# Altium schematic sheet Driver.SchDoc
size A4; Author: Shohei Aoki; Organization: Shokara Inc.; Address1: Yokohama, Japan
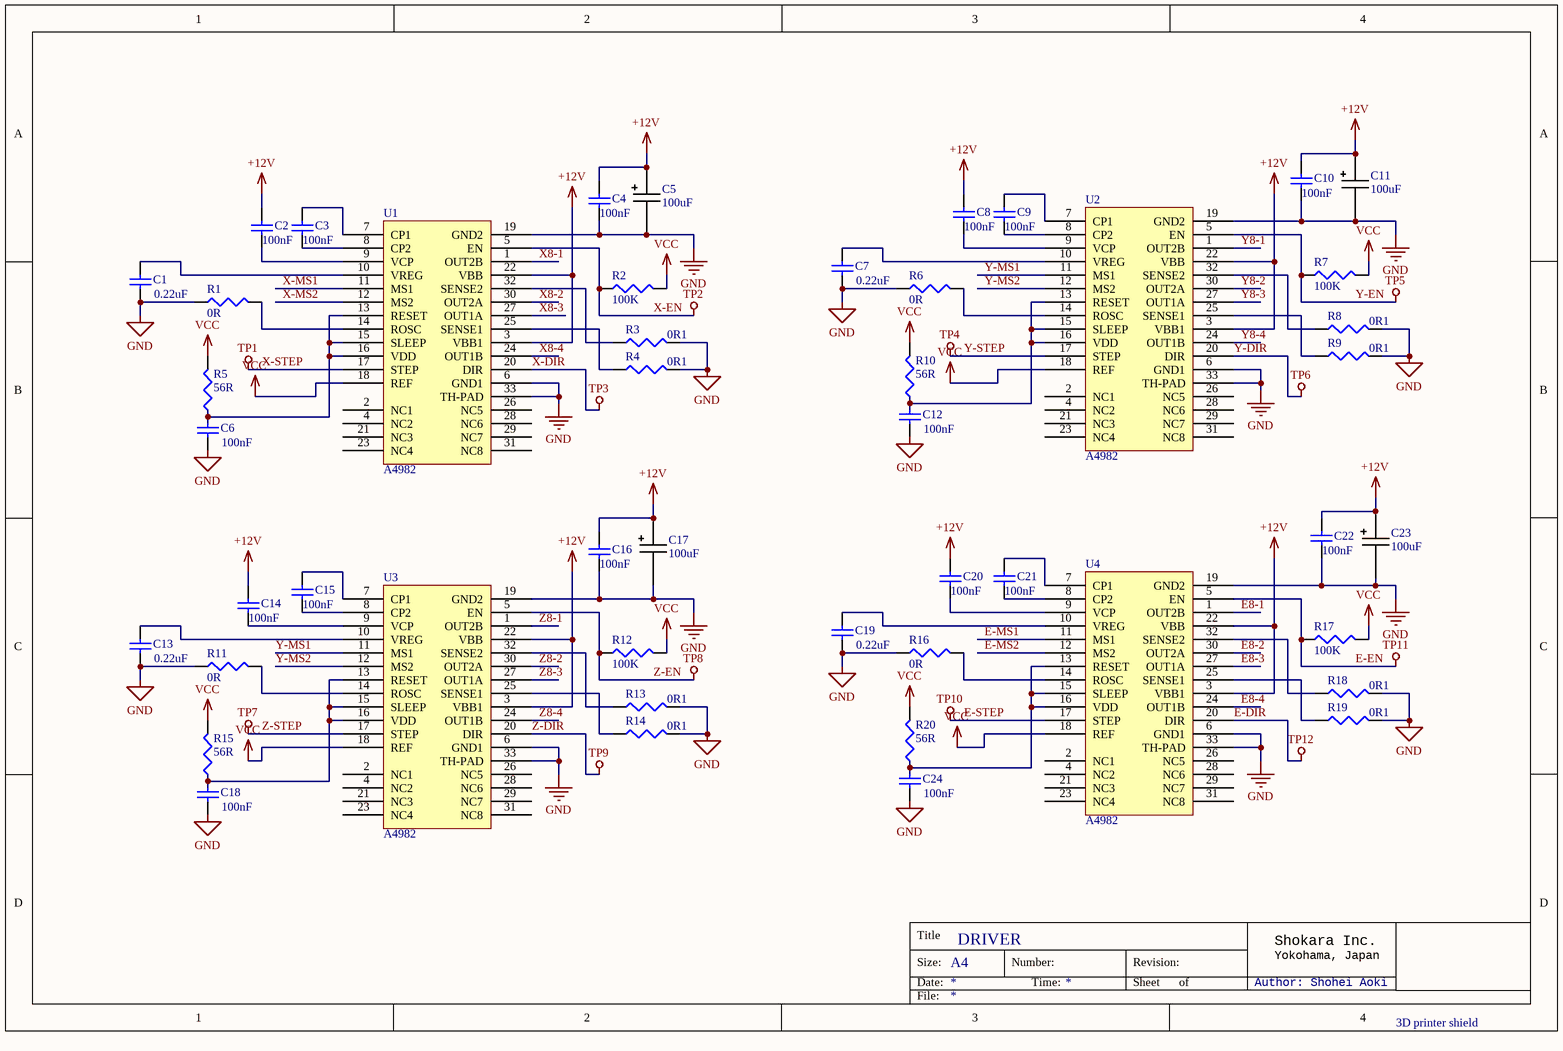
[diagram p0: Driver.SchDoc]

## Parts
C1  value 0.22uF  [1608[0603]]
C2  value 100nF  [1608[0603]]
C3  value 100nF  [1608[0603]]
C4  value 100nF  [1608[0603]]
C5  *  [EEE-1HA470XP]  (value not drawn)
C6  value 100nF  [1608[0603]]
C7  value 0.22uF  [1608[0603]]
C8  value 100nF  [1608[0603]]
C9  value 100nF  [1608[0603]]
C10  value 100nF  [1608[0603]]
C11  *  [EEE-1HA470XP]  (value not drawn)
C12  value 100nF  [1608[0603]]
C13  value 0.22uF  [1608[0603]]
C14  value 100nF  [1608[0603]]
C15  value 100nF  [1608[0603]]
C16  value 100nF  [1608[0603]]
C17  *  [EEE-1HA470XP]  (value not drawn)
C18  value 100nF  [1608[0603]]
C19  value 0.22uF  [1608[0603]]
C20  value 100nF  [1608[0603]]
C21  value 100nF  [1608[0603]]
C22  value 100nF  [1608[0603]]
C23  *  [EEE-1HA470XP]  (value not drawn)
C24  value 100nF  [1608[0603]]
R1  value 0R  [J1-0603]
R2  value 100K  [J1-0603]
R3  value 0R1  [J1-0603]
R4  value 0R1  [J1-0603]
R5  value 56R  [J1-0603]
R6  value 0R  [J1-0603]
R7  value 100K  [J1-0603]
R8  value 0R1  [J1-0603]
R9  value 0R1  [J1-0603]
R10  value 56R  [J1-0603]
R11  value 0R  [J1-0603]
R12  value 100K  [J1-0603]
R13  value 0R1  [J1-0603]
R14  value 0R1  [J1-0603]
R15  value 56R  [J1-0603]
R16  value 0R  [J1-0603]
R17  value 100K  [J1-0603]
R18  value 0R1  [J1-0603]
R19  value 0R1  [J1-0603]
R20  value 56R  [J1-0603]
U1  A4982  [QFN50P500X500X100_HS-33N_2]
U2  A4982  [QFN50P500X500X100_HS-33N_2]
U3  A4982  [QFN50P500X500X100_HS-33N_2]
U4  A4982  [QFN50P500X500X100_HS-33N_2]

## Nets
+12V: C2.2 C4.2 C5.2 C8.2 C10.2 C11.2 C14.2 C16.2 C17.2 C20.2 C22.2 C23.2 U1.3(VBB1) U1.22(VBB) U2.3(VBB1) U2.22(VBB) U3.3(VBB1) U3.22(VBB) U4.3(VBB1) U4.22(VBB)
E-DIR: U4.20(DIR)  [also labelled TP12]
E-EN: R17.1 U4.5(EN)  [also labelled TP11]
E-STEP: U4.17(STEP)  [also labelled TP10]
GND: C1.1 C4.1 C5.1 C6.1 C7.1 C10.1 C11.1 C12.1 C13.1 C16.1 C17.1 C18.1 C19.1 C22.1 C23.1 C24.1 R1.1 R3.2 R4.2 R6.1 R8.2 R9.2 R11.1 R13.2 R14.2 R16.1 R18.2 R19.2 U1.6(GND1) U1.19(GND2) U1.33(TH-PAD) U2.6(GND1) U2.19(GND2) U2.33(TH-PAD) U3.6(GND1) U3.19(GND2) U3.33(TH-PAD) U4.6(GND1) U4.19(GND2) U4.33(TH-PAD)
VCC: R2.2 R5.2 R7.2 R10.2 R12.2 R15.2 R17.2 R20.2 U1.18(REF) U2.18(REF) U3.18(REF) U4.18(REF)
X-DIR: U1.20(DIR)  [also labelled TP3]
X-EN: R2.1 U1.5(EN)  [also labelled TP2]
X-STEP: U1.17(STEP)  [also labelled TP1]
Y-DIR: U2.20(DIR)  [also labelled TP6]
Y-EN: R7.1 U2.5(EN)  [also labelled TP5]
Y-STEP: U2.17(STEP)  [also labelled TP4]
Z-DIR: U3.20(DIR)  [also labelled TP9]
Z-EN: R12.1 U3.5(EN)  [also labelled TP8]
Z-STEP: U3.17(STEP)  [also labelled TP7]
E8-1: U4.1(OUT2B)
E8-2: U4.30(OUT2A)
E8-3: U4.27(OUT1A)
E8-4: U4.24(OUT1B)
E-MS1: U4.11(MS1)
E-MS2: U4.12(MS2)
X8-1: U1.1(OUT2B)
X8-2: U1.30(OUT2A)
X8-3: U1.27(OUT1A)
X8-4: U1.24(OUT1B)
X-MS1: U1.11(MS1)
X-MS2: U1.12(MS2)
Y8-1: U2.1(OUT2B)
Y8-2: U2.30(OUT2A)
Y8-3: U2.27(OUT1A)
Y8-4: U2.24(OUT1B)
Y-MS1: U2.11(MS1) U3.11(MS1)
Y-MS2: U2.12(MS2) U3.12(MS2)
Z8-1: U3.1(OUT2B)
Z8-2: U3.30(OUT2A)
Z8-3: U3.27(OUT1A)
Z8-4: U3.24(OUT1B)
NetC1_2: C1.2 U1.10(VREG)
NetC2_1: C2.1 U1.9(VCP)
NetC3_1: C3.1 U1.8(CP2)
NetC3_2: C3.2 U1.7(CP1)
NetC6_2: C6.2 R5.1 U1.13(RESET) U1.15(SLEEP) U1.16(VDD)
NetC7_2: C7.2 U2.10(VREG)
NetC8_1: C8.1 U2.9(VCP)
NetC9_1: C9.1 U2.8(CP2)
NetC9_2: C9.2 U2.7(CP1)
NetC12_2: C12.2 R10.1 U2.13(RESET) U2.15(SLEEP) U2.16(VDD)
NetC13_2: C13.2 U3.10(VREG)
NetC14_1: C14.1 U3.9(VCP)
NetC15_1: C15.1 U3.8(CP2)
NetC15_2: C15.2 U3.7(CP1)
NetC18_2: C18.2 R15.1 U3.13(RESET) U3.15(SLEEP) U3.16(VDD)
NetC19_2: C19.2 U4.10(VREG)
NetC20_1: C20.1 U4.9(VCP)
NetC21_1: C21.1 U4.8(CP2)
NetC21_2: C21.2 U4.7(CP1)
NetC24_2: C24.2 R20.1 U4.13(RESET) U4.15(SLEEP) U4.16(VDD)
NetR1_2: R1.2 U1.14(ROSC)
NetR3_1: R3.1 U1.32(SENSE2)
NetR4_1: R4.1 U1.25(SENSE1)
NetR6_2: R6.2 U2.14(ROSC)
NetR8_1: R8.1 U2.32(SENSE2)
NetR9_1: R9.1 U2.25(SENSE1)
NetR11_2: R11.2 U3.14(ROSC)
NetR13_1: R13.1 U3.32(SENSE2)
NetR14_1: R14.1 U3.25(SENSE1)
NetR16_2: R16.2 U4.14(ROSC)
NetR18_1: R18.1 U4.32(SENSE2)
NetR19_1: R19.1 U4.25(SENSE1)

Not connected (* = marked no-connect by the designer): U1 2(NC1) 4(NC2) 21(NC3) 23(NC4) 26(NC5) 28(NC6) 29(NC7) 31(NC8); U2 2(NC1) 4(NC2) 21(NC3) 23(NC4) 26(NC5) 28(NC6) 29(NC7) 31(NC8); U3 2(NC1) 4(NC2) 21(NC3) 23(NC4) 26(NC5) 28(NC6) 29(NC7) 31(NC8); U4 2(NC1) 4(NC2) 21(NC3) 23(NC4) 26(NC5) 28(NC6) 29(NC7) 31(NC8)

## Notes on the sheet
- DRIVER
- 3D printer shield
- Title
- Size:
- Date:
- A4
- Number:
- Time:
- Revision:
- Sheet
- of
- Author: Shohei Aoki
- Shokara Inc.
- Yokohama, Japan
- File:
- (in symbol Cap_alumi_electrolytic) 100uF

## Library data of the parts
C1-C4 C6-C10 C12-C16 C18-C22 C24 = Cap Semi: Capacitor (Semiconductor SIM Model); Published: 8-Jun-2000; LatestRevisionDate: 29-May-2009; LatestRevisionNote: IPC-7351 Footprint Added.; PackageReference: C1206; Publisher: Altium Limited; PackageDescription: Chip Capacitor
C5 C11 C17 C23 = Cap_alumi_electrolytic
R1-R20 = Res3: Resistor; Published: 8-Jun-2000; LatestRevisionDate: 29-May-2009; LatestRevisionNote: IPC-7351 Footprint Added.; PackageReference: J1-0603; Publisher: Altium Limited; PackageDescription: Chip Resistor